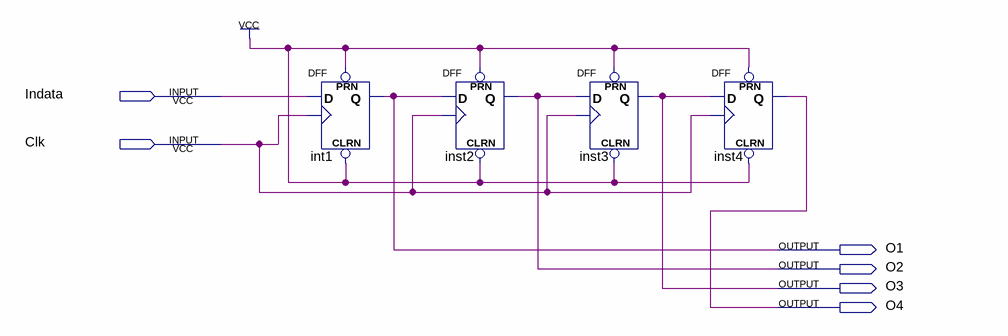
[diagram p0: schematic sheet]
// Quartus schematic lab10step1.bdf as structural Verilog: 4 symbols, 6 pins
module lab10step1 (
  input  Indata,
  input  Clk,
  output O1,
  output O2,
  output O3,
  output O4
);

  DFF int1 (.CLRN(1'b1), .CLK(Clk), .D(Indata), .PRN(1'b1), .Q(O1));
  DFF inst2 (.CLRN(1'b1), .CLK(Clk), .D(O1), .PRN(1'b1), .Q(O2));
  DFF inst3 (.CLRN(1'b1), .CLK(Clk), .D(O2), .PRN(1'b1), .Q(O3));
  DFF inst4 (.CLRN(1'b1), .CLK(Clk), .D(O3), .PRN(1'b1), .Q(O4));
endmodule
